# EAGLE design Arduino101BiomedDevBoard (EAGLE 8.1.0)
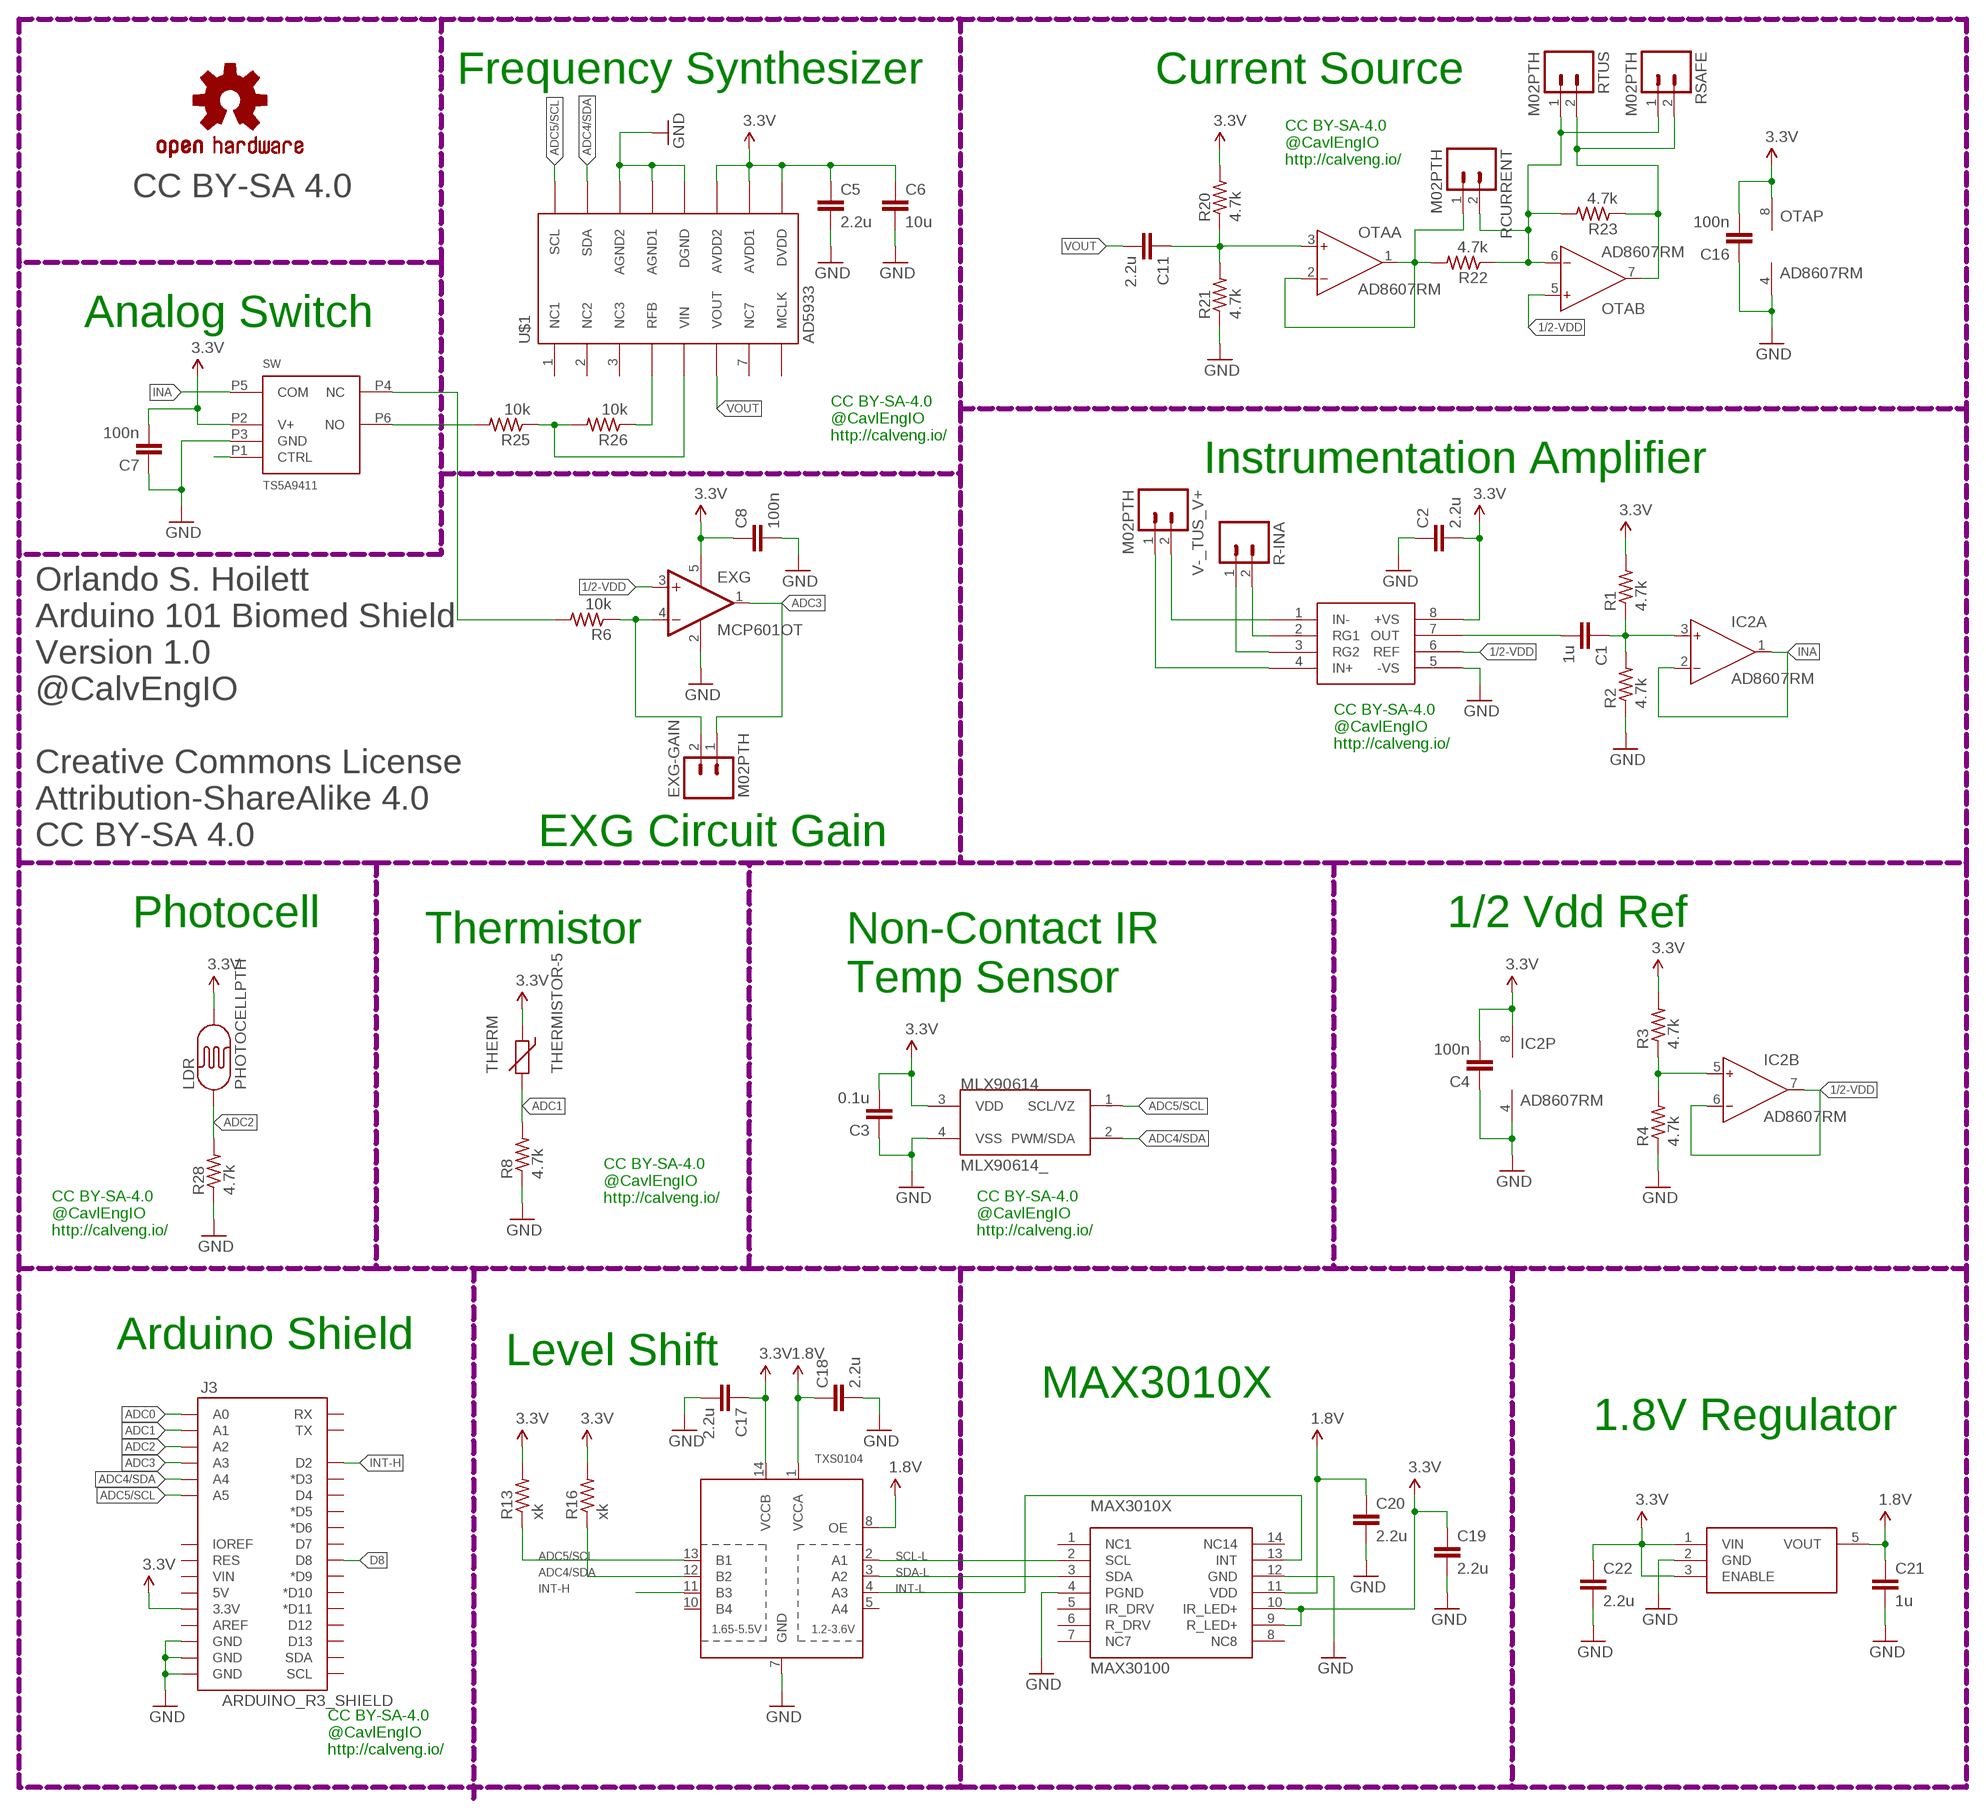
[diagram p0: schematic, sheet 1]

## Parts
1.8V  MIC5504  [SOT23-5]
C1  1u  C-EUC0402  [C0402]
C2  2.2u  C-EUC0402  [C0402]
C3  0.1u  C-EUC0402  [C0402]
C4  100n  C-EUC0402  [C0402]
C5  2.2u  C-EUC0402  [C0402]
C6  10u  C-EUC0805  [C0805]
C7  100n  C-EUC0402  [C0402]
C8  100n  C-EUC0402  [C0402]
C11  2.2u  C-EUC0402  [C0402]
C16  100n  C-EUC0402  [C0402]
C17  2.2u  C-EUC0402  [C0402]
C18  2.2u  C-EUC0402  [C0402]
C19  2.2u  C-EUC0402  [C0402]
C20  2.2u  C-EUC0402  [C0402]
C21  1u  C-EUC0402  [C0402]
C22  2.2u  C-EUC0402  [C0402]
EXG  MCP601OT  [SOT23-5]
EXG-GAIN  M02PTH  [1X02]
IC2  AD8607RM  [MSOP08]
INA  AD8220  [MSOP08]
J3  ARDUINO_R3_SHIELD  [UNO_R3_SHIELD]
LDR  PHOTOCELLPTH  [PHOTOCELL]
LOGO3  OSHW-LOGOM  [OSHW-LOGO-M]
MAX3010X  MAX30100  [OESIP14]
MLX90614  MLX90614_  [TO-39]
OTA  AD8607RM  [MSOP08]
R1  4.7k  R-US_R0402  [R0402]
R2  4.7k  R-US_R0402  [R0402]
R3  4.7k  R-US_R0402  [R0402]
R4  4.7k  R-US_R0402  [R0402]
R6  10k  R-US_R0402  [R0402]
R8  4.7k  R-US_R0402  [R0402]
R13  xk  R-US_R0402  [R0402]
R16  xk  R-US_R0402  [R0402]
R20  4.7k  R-US_R0402  [R0402]
R21  4.7k  R-US_R0402  [R0402]
R22  4.7k  R-US_R0402  [R0402]
R23  4.7k  R-US_R0402  [R0402]
R25  10k  R-US_R0402  [R0402]
R26  10k  R-US_R0402  [R0402]
R28  4.7k  R-US_R0402  [R0402]
R-INA  M02PTH  [1X02]
RCURRENT  M02PTH  [1X02]
RSAFE  M02PTH  [1X02]
RTUS  M02PTH  [1X02]
SW  TS5A9411  [SOT-363]
THERM  THERMISTOR-5  [R-5]
TXS0104  TXB0104PWR  [TSSOP14]
U$1  AD5933  [SSOP-16]
V-_TUS_V+  M02PTH  [1X02]

## Nets
1.8V: 1.8V.5(VOUT) C18.1 C20.1 C21.1 MAX3010X.11(VDD) TXS0104.1(VCCA) TXS0104.8(OE)
1/2-VDD: EXG.3(+IN) IC2.6(B:IN-) IC2.7(B:OUT) INA.6(REF) OTA.5(B:IN+)
3.3V: 1.8V.1(VIN) 1.8V.3(ENABLE) C2.2 C3.2 C4.2 C5.1 C6.1 C7.2 C8.1 C16.2 C17.1 C19.1 C22.1 EXG.5(V+) IC2.8(P:V+) INA.8(+VS) J3.3.3V LDR.2 MAX3010X.9(R_LED+) MAX3010X.10(IR_LED+) MLX90614.3(VDD) OTA.8(P:V+) R1.2 R3.2 R13.2 R16.2 R20.2 SW.P2(V+) THERM.1 TXS0104.14(VCCB) U$1.9(DVDD) U$1.10(AVDD1) U$1.11(AVDD2)
ADC0: J3.A0
ADC1: J3.A1 R8.2 THERM.2
ADC2: J3.A2 LDR.1 R28.2
ADC3: EXG-GAIN.1 EXG.1(OUT) J3.A3
ADC4/SDA: J3.A4 MLX90614.2(PWM/SDA) R16.1 TXS0104.12(B2) U$1.15(SDA)
ADC5/SCL: J3.A5 MLX90614.1(SCL/VZ) R13.1 TXS0104.13(B1) U$1.16(SCL)
D8: J3.D8 SW.P1(CTRL)
GND: 1.8V.2(GND) C2.1 C3.1 C4.1 C5.2 C6.2 C7.1 C8.2 C16.1 C17.2 C18.2 C19.2 C20.2 C21.2 C22.2 EXG.2(V-) IC2.4(P:V-) INA.5(-VS) J3.GND@0(GND) J3.GND@1(GND) J3.GND@2(GND) MAX3010X.4(PGND) MAX3010X.12(GND) MLX90614.4(VSS) OTA.4(P:V-) R2.1 R4.1 R8.1 R21.1 R28.1 SW.P3(GND) TXS0104.7(GND) U$1.12(DGND) U$1.13(AGND1) U$1.14(AGND2)
INA: IC2.1(A:OUT) IC2.2(A:IN-) SW.P5(COM)
INT-H: J3.D2 TXS0104.11(B3)
INT-L: MAX3010X.13(INT) TXS0104.4(A3)
N$1: C1.1 IC2.3(A:IN+) R1.1 R2.2
N$3: C1.2 INA.7(OUT)
N$4: IC2.5(B:IN+) R3.1 R4.2
N$6: INA.3(RG2) R-INA.1
N$7: EXG-GAIN.2 EXG.4(-IN) R6.1
N$9: C11.1 OTA.3(A:IN+) R20.1 R21.2
N$10: R25.2 SW.P6(NO)
N$12: R25.1 R26.2 U$1.5(VIN)
N$13: R6.2 SW.P4(NC)
N$14: OTA.1(A:OUT) OTA.2(A:IN-) R22.2 RCURRENT.1
N$16: OTA.6(B:IN-) R22.1 R23.2 RCURRENT.2 RSAFE.1 RTUS.1
N$17: OTA.7(B:OUT) R23.1 RSAFE.2 RTUS.2
N$18: INA.1(IN-) V-_TUS_V+.2
N$19: INA.4(IN+) V-_TUS_V+.1
N$20: INA.2(RG1) R-INA.2
N$24: R26.1 U$1.4(RFB)
SCL-L: MAX3010X.2(SCL) TXS0104.2(A1)
SDA-L: MAX3010X.3(SDA) TXS0104.3(A2)
VOUT: C11.2 U$1.6(VOUT)
Unconnected: J3.5V J3.AREF J3.D3(*D3) J3.D4 J3.D5(*D5) J3.D6(*D6) J3.D7 J3.D9(*D9) J3.D10(*D10) J3.D11(*D11) J3.D12 J3.D13 J3.IOREF J3.RES J3.RX J3.SCL J3.SDA J3.TX J3.VIN MAX3010X.1(NC1) MAX3010X.5(IR_DRV) MAX3010X.6(R_DRV) MAX3010X.7(NC7) MAX3010X.8(NC8) MAX3010X.14(NC14) TXS0104.5(A4) TXS0104.10(B4) U$1.1(NC1) U$1.2(NC2) U$1.3(NC3) U$1.7(NC7) U$1.8(MCLK)

## Notes on the sheet
- Frequency Synthesizer | Current Source
- CC BY-SA-4.0
  @CavlEngIO
  http://calveng.io/
- CC BY-SA 4.0
- Analog Switch
- CC BY-SA-4.0
  @CavlEngIO
  http://calveng.io/
- Instrumentation Amplifier
- CC BY-SA-4.0
  @CavlEngIO
  http://calveng.io/
- Orlando S. Hoilett
  Arduino 101 Biomed Shield
  Version 1.0
  @CalvEngIO
  
  Creative Commons License
  Attribution-ShareAlike 4.0
  CC BY-SA 4.0
- EXG Circuit Gain
- Photocell | 1/2 Vdd Ref
- Thermistor
- Non-Contact IR
  Temp Sensor
- CC BY-SA-4.0
  @CavlEngIO
  http://calveng.io/
- CC BY-SA-4.0
  @CavlEngIO
  http://calveng.io/
- CC BY-SA-4.0
  @CavlEngIO
  http://calveng.io/
- Arduino Shield
- Level Shift
- MAX3010X
- 1.8V Regulator
- CC BY-SA-4.0
  @CavlEngIO
  http://calveng.io/

## Library data of the parts
1.8V = OrlandoRonMod:MIC5504
C1-C8 C11 C16-C22 = resistor:C-EU: CAPACITOR, European symbol
EXG = linear:MCP601: Single Op Amp 2.7V to 6.0V Single Supply CMOS Source: http://ww1.microchip.com/downloads/en/DeviceDoc/21314g.pdf
EXG-GAIN R-INA RCURRENT RSAFE RTUS V-_TUS_V+ = SparkFun-Connectors:M02: Standard 2-pin 0.1" header. Use with - straight break away headers ( PRT-00116) - right angle break away headers (PRT-00553) - swiss pins (PRT-00743) - machine pins (PRT-00117) - female headers (PRT-00115) Molex polarized connector foot print use with: PRT-08233 with associated crimp pins and housings. 2.54_SCREWTERM for use with PRT-10571. 3.5mm Screw Terminal footprints for PRT-08084 5mm Screw Terminal footprints for use with PRT-08432
IC2 OTA = analog-devices:AD8607: Precision Micropower, Low Noise CMOS, Rail-to-Rail Input/Output Operational Amplifiers Source: http://www.analog.com/static/imported-files/data_sheets/AD8603_8607_8609.pdf; MF: ALTERA CORPORATION; MPN: AD8607ARMZ-REEL; OC_FARNELL: 1464990; OC_NEWARK: 59K6925
INA = Orlando:AD8220
J3 = SparkFun-Boards:ARDUINO_R3_SHIELD: Shield form compatible with the Arduino Uno R3.
LDR = SparkFun-Sensors:PHOTOCELL: CdS photoresistor. This is a low cost way to detect light levels. Resistance decreases with more incoming light. SparkFun SKU: SEN-09088
LOGO3 = SparkFun-Aesthetics:OSHW-LOGO: Open Source Hardware Logo This logo indicates the piece of hardware it is found on incorporates a OSHW license and/or adheres to the definition of open source hardware found here: http://freedomdefined.org/OSHW
MAX3010X = OrlandoRonMod:MAX30100
MLX90614 = SparkFun-Sensors:MLX90614: Non-contact PIR I2C interface temperature sensor
R1-R4 R6 R8 R13 R16 R20-R23 R25 R26 R28 = resistor:R-US_: RESISTOR, American symbol
SW = Orlando:TS5A9411
THERM = varistor:THERMISTOR: THERMISTOR
TXS0104 = SparkFun-DigitalIC:TXB0104PWR: 4-Bit Bi-Directional Level Shifter 1.2V-3.6V (VCCA) to 1.65V-5.5V (VCCB) bi-directional level shifter with auto direction sensing. Max data rate - VCCA 1.8V: 20Mbps (50ns), VCCA 3.3V: 100Mbps (10ns) Digikey: 296-21929-1-ND (TSSOP) IC-11329
U$1 = Orlando:AD5933

## Net classes
0 default: width 0.152 mm, drill 0.305 mm, clearance 0.152 mm

## Board
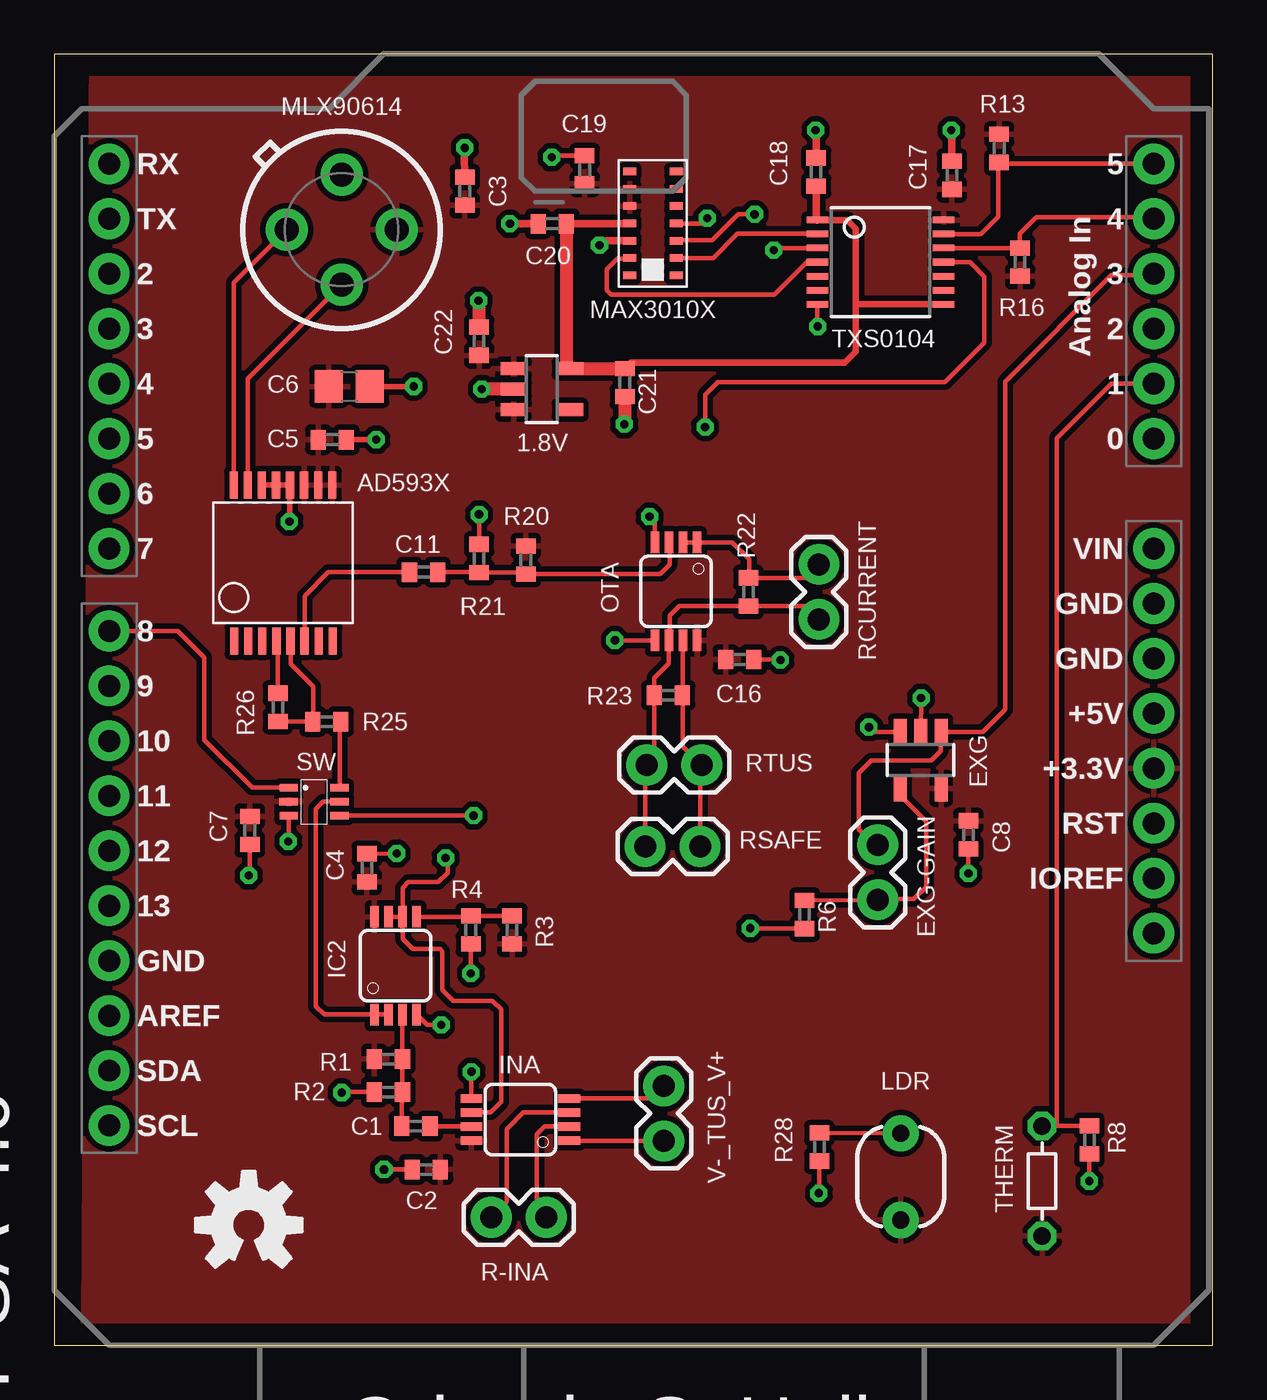
[diagram p1: board, top side]
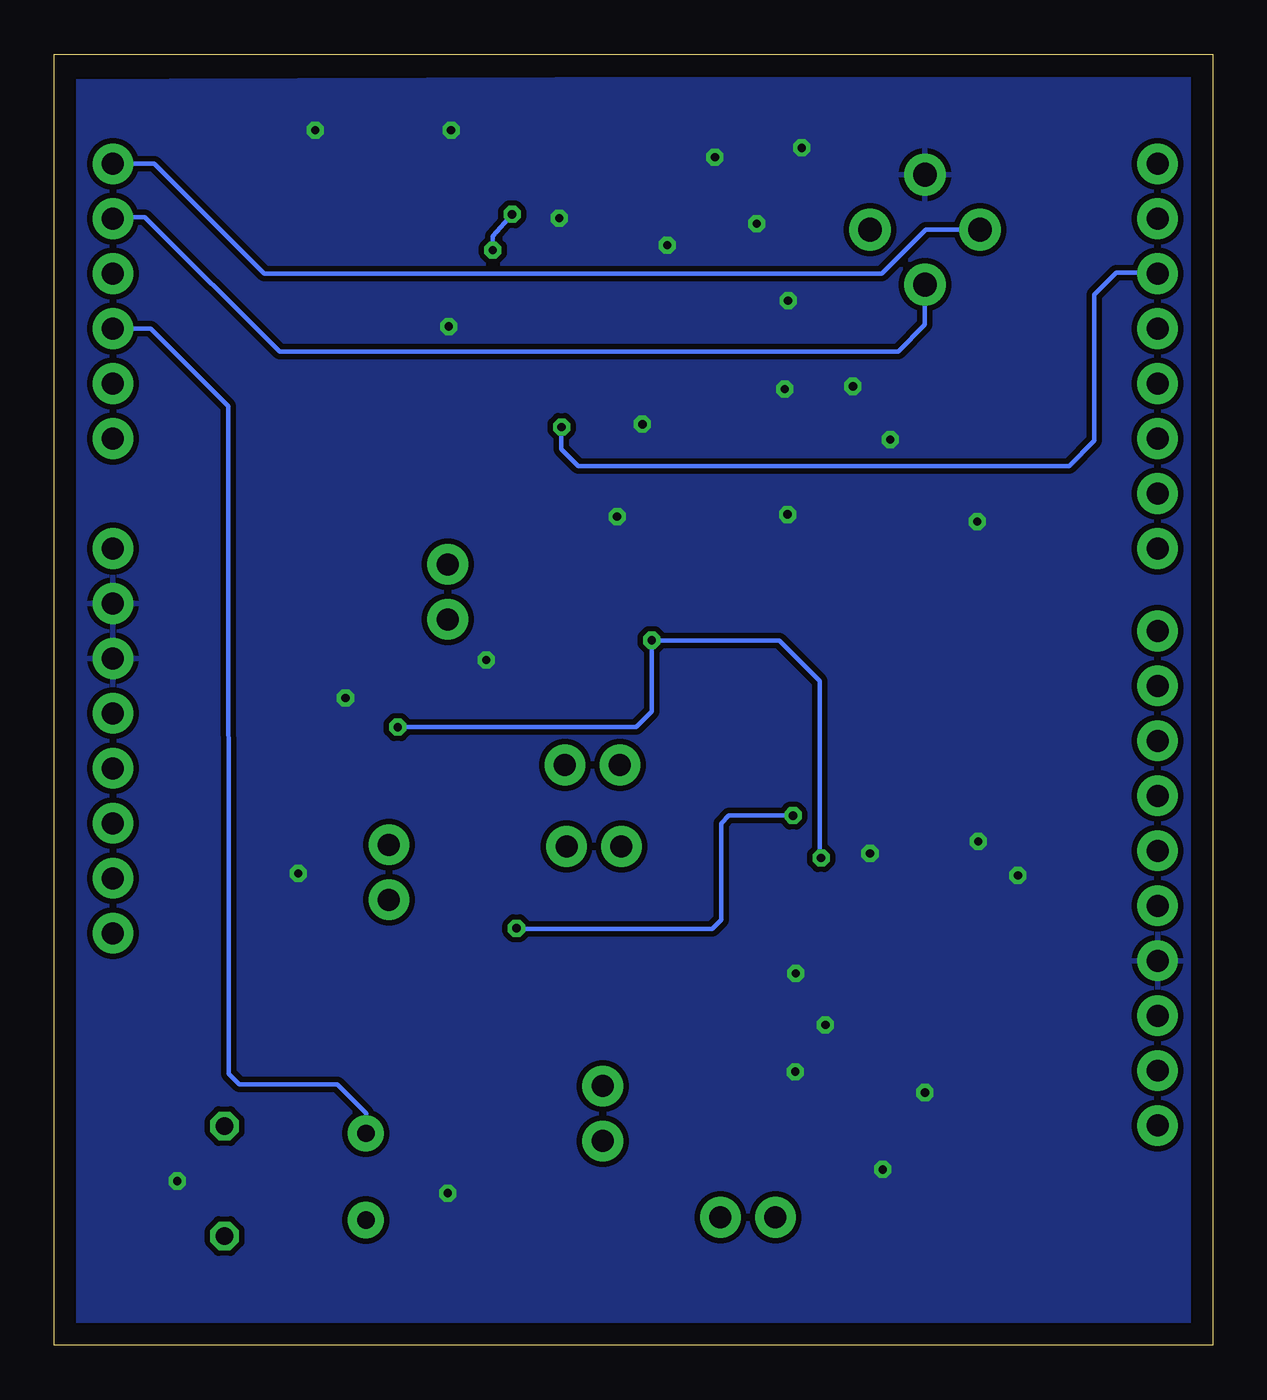
[diagram p2: board, bottom side, seen from below]

Size 53.52 x 59.68 mm. Coordinates in mm from the lower left corner, seen from the top.
Outline: 0,0 53.52,0 53.52,59.68 0,59.68 0,0
Copper layers (1*16): Top 0.035mm / dielectric 1.5mm / Bottom 0.035mm
Design rules "default": minimum track width 10mil, minimum drill 24mil, track to track 8mil, track to pad 8mil, pad to pad 8mil, via to via 8mil, smd to smd 8mil, copper to edge 40mil, drill to drill 8mil, minimum pad ring 10mil, minimum via ring 8mil, stop-mask expansion 4mil, vias tented up to drill 0mil, thermal gap 10mil

### Footprints (pad centres in the part's own frame; a part is rotated, then mirrored left to right if it is on the bottom)
SOT23-5 = smd 0.6 x 1.2: 1 -0.95,-1.306; 2 0,-1.306; 3 0.95,-1.306; 4 0.95,1.306; 5 -0.95,1.306
C0402 = smd 0.7 x 0.9: 1 -0.65,0; 2 0.65,0
C0805 = smd 1.3 x 1.5: 1 -0.95,0; 2 0.95,0
1X02 = drill 1.016 pad 1.88: 1 0,0; 2 2.54,0
MSOP08 = smd 0.4 x 1: 1 -0.976,-2.263; 2 -0.326,-2.263; 3 0.324,-2.263; 4 0.974,-2.263; 5 0.974,2.262; 6 0.324,2.262; 7 -0.326,2.262; 8 -0.976,2.262
UNO_R3_SHIELD = drill 1.016 pad 1.88: 3.3V 50.8,26.67; 5V 50.8,29.21; A0 50.8,41.91; A1 50.8,44.45; A2 50.8,46.99; A3 50.8,49.53; A4 50.8,52.07; A5 50.8,54.61; AREF 2.54,15.24; D2 2.54,49.53; D3 2.54,46.99; D4 2.54,44.45; D5 2.54,41.91; D6 2.54,39.37; D7 2.54,36.83; D8 2.54,33.02; D9 2.54,30.48; D10 2.54,27.94; D11 2.54,25.4; D12 2.54,22.86; D13 2.54,20.32; GND@0 50.8,31.75; GND@1 50.8,34.29; GND@2 2.54,17.78; IOREF 50.8,21.59; NC 50.8,19.05; RES 50.8,24.13; RX 2.54,54.61; SCL 2.54,10.16; SDA 2.54,12.7; TX 2.54,52.07; VIN 50.8,36.83
PHOTOCELL = drill 0.8 pad 1.676: 1 -2,0; 2 2,0
OESIP14 = smd 0.6 x 0.35: 1 -1.08,2.54; 2 -1.08,1.74; 3 -1.08,0.94; 4 -1.08,0.14; 5 -1.08,-0.66; 6 -1.08,-1.46; 7 -1.08,-2.26; 8 1.07,-2.26; 9 1.07,-1.46; 10 1.07,-0.66; 11 1.07,0.14; 12 1.07,0.94; 13 1.07,1.74; 14 1.07,2.54
TO-39 = drill 1.1 pad 1.93: 1 2.54,0; 2 0,2.54; 3 -2.54,0; 4 0,-2.54
R0402 = smd 0.7 x 0.9: 1 -0.65,0; 2 0.65,0
SOT-363 = smd 0.85 x 0.35: P1 -1.176,0.611; P2 -1.18,-0.038; P3 -1.176,-0.689; P4 1.172,-0.689; P5 1.168,-0.038; P6 1.172,0.611
R-5 = drill 0.813 octagon: 1 -2.54,0; 2 2.54,0
TSSOP14 = smd 0.305 x 0.991: 1 -1.95,-2.918; 2 -1.3,-2.918; 3 -0.65,-2.918; 4 0,-2.918; 5 0.65,-2.918; 6 1.3,-2.918; 7 1.95,-2.918; 8 1.95,2.918; 9 1.3,2.918; 10 0.65,2.918; 11 0,2.918; 12 -0.65,2.918; 13 -1.3,2.918; 14 -1.95,2.918
SSOP-16 = smd 1.25 x 0.38: 1 -3.583,2.017; 2 -3.583,1.367; 3 -3.583,0.716; 4 -3.583,0.066; 5 -3.583,-0.584; 6 -3.583,-1.234; 7 -3.583,-1.885; 8 -3.583,-2.535; 9 3.627,-2.51; 10 3.627,-1.859; 11 3.627,-1.209; 12 3.627,-0.559; 13 3.627,0.091; 14 3.627,0.742; 15 3.627,1.392; 16 3.627,2.042

### Placement (x,y rotation side)
1.8V  22.53,44.2 270 top
C1  16.71,10.13 0 top
C2  17.2,8.13 0 top
C3  18.97,53.34 270 top
C4  14.45,22.07 270 top
C5  12.85,41.86 0 top
C6  13.64,44.32 0 top
C7  9.04,23.8 90 top
C8  42.24,23.6 270 top
C11  17.07,35.74 180 top
C16  31.67,31.7 180 top
C17  41.48,54.08 90 top
C18  35.2,54.23 90 top
C19  24.51,54.33 90 top
C20  23.01,51.84 180 top
C21  26.37,44.5 270 top
C22  19.63,46.41 90 top
EXG  40.03,27.05 180 top
EXG-GAIN  38.05,23.14 270 top
IC2  15.77,17.55 0 top
INA  21.54,10.44 90 top
J3  0,0 0 top
LDR  39.12,7.8 270 top
LOGO3  8.99,5.56 0 top
MAX3010X  27.66,51.99 180 top
MLX90614  13.28,51.56 180 top
OTA  28.73,34.85 180 top
R1  15.44,13.23 180 top
R2  15.44,11.71 0 top
R3  21.16,19.2 270 top
R4  19.25,19.2 90 top
R6  34.67,19.91 270 top
R8  47.83,9.5 90 top
R13  43.66,55.32 90 top
R16  44.63,50.06 270 top
R20  21.79,36.3 90 top
R21  19.63,36.37 270 top
R22  32.08,34.82 90 top
R23  28.37,30.05 180 top
R25  12.6,28.83 0 top
R26  10.34,29.49 270 top
R28  35.36,9.17 90 top
R-INA  20.19,5.92 0 top
RCURRENT  35.33,36.09 270 top
RSAFE  27.3,23.06 0 top
RTUS  27.38,26.82 0 top
SW  12.01,25.17 0 top
THERM  45.64,7.59 90 top
TXS0104  38.18,50.06 270 top
U$1  10.34,36.14 90 top
V-_TUS_V+  28.17,11.99 270 top

### Tracks (layer width: path | path; a pad name or v marks a point on that pad's centre or on a via)
1.8V
  Top 0.305: TXS0104.1 36.63,52.01 37.03,51.61 37.03,48.03 | 37.03,48.03 37.03,45.92 36.52,45.41 26.63,45.41 C21.1 | TXS0104.8 37.12,48.11 37.03,48.03
  Top 0.356: 23.66,45.32 1.8V.5 | C20.1 26.58,51.84 MAX3010X.11 | C21.1 | C18.1 35.2,52.07 TXS0104.1
  Top 0.61: C20.1 23.66,45.32 | 1.8V.5 C21.1
1/2-VDD  (via drill 0.38)
  Top 0.203: IC2.7 IC2.6 | IC2.6 16.1,21.15 16.36,21.41 17.75,21.41 18.19,21.84 18.19,22.43 v18.09,22.53 | v25.91,32.59 OTA.5 | EXG.3 37.86,28.36 v37.64,28.57 | IC2.6 16.1,18.78 16.56,18.31 17.83,18.31 17.93,18.21 17.93,16.43 18.44,15.93 20.24,15.93 20.65,15.52 20.65,11.25 20.17,10.77 INA.6
  Bottom 0.203: v37.64,28.57 26.62,28.57 25.91,29.29 v25.91,32.59 20.02,32.59 18.14,30.71 18.14,22.58 v18.09,22.53
3.3V
  pour Top (isolate 0.254): 1.73,60.12 53.19,60.12 53.19,1.02 1.35,1.02
ADC1
  Top 0.203: J3.A1 48.84,44.45 46.33,41.94 46.33,10.18 46.41,10.15 | R8.2 46.41,10.15 | 46.41,10.15 45.68,10.15 THERM.2
ADC2
  Top 0.203: LDR.1 R28.2
  Bottom 0.203: 39.15,9.83 LDR.1 39.09,9.82 39.09,10.72 40.44,12.06 44.96,12.06 45.44,12.55 45.44,12.88 45.47,43.41 49.05,46.99 J3.A2
ADC3
  Top 0.203: J3.A3 50.72,49.45 48.84,49.45 43.94,44.55 43.94,29.39 42.91,28.36 EXG.1 40.97,28.35 40.97,27.48 40.51,27.03 37.74,27.03 37.19,26.47 37.19,23.85 37.9,23.14 EXG-GAIN.1
ADC4/SDA
  Top 0.203: TXS0104.12 R16.1 44.6,50.74 44.6,51.38 45.36,52.15 50.72,52.15 J3.A4 | U$1.15 8.95,44.68 MLX90614.2
  Bottom 0.203: MLX90614.2 13.28,47.17 14.53,45.92 43.1,45.92 49.33,52.15 50.72,52.15 J3.A4
ADC5/SCL
  Top 0.203: J3.A5 43.72,54.61 R13.1 43.61,54.62 43.61,52.17 42.8,51.36 TXS0104.13 | U$1.16 8.3,49.11 MLX90614.1
  Bottom 0.203: MLX90614.1 13.26,51.56 15.29,49.53 43.81,49.53 48.9,54.61 J3.A5
D8
  Top 0.203: J3.D8 5.71,33.02 6.93,31.8 6.93,27.99 9.14,25.78 SW.P1
GND  (via drill 0.38)
  Top 0.203: R28.1 35.36,7.06 v35.33,7.04 | MAX3010X.4 29.93,51.85 v30.18,52.09 | TXS0104.7 35.26,47.11 v35.28,47.09 | OTA.4 27.75,38.06 v27.51,38.3 | C16.1 33.53,31.7 v33.55,31.67 | SW.P3 10.84,23.31 v10.82,23.29 | C7.1 9.04,21.77 v8.99,21.72 | EXG.2 v40.06,29.92 | C8.2 v42.24,21.82 | C4.1 v15.82,22.73 | C2.1 v15.24,8.13 | INA.5 v19.28,12.65 | v19.25,17.2 R4.1 | v17.88,14.81 17.23,14.81 IC2.4 | R2.1 13.31,11.71 v13.28,11.68 | R21.1 v19.63,38.41 | R8.1 v47.83,7.59 | C19.2 23.05,54.98 v22.99,54.91
  Top 0.254: U$1.14 U$1.13 U$1.12 10.9,38.1 v10.87,38.08 | C5.2 v14.88,41.86 | C6.2 v16.61,44.32
  Top 0.356: C20.2 v21.06,51.84 | 26.36,42.6 v26.34,42.57 | MAX3010X.12 25.53,51.05 v25.2,50.85 | C18.2 35.2,55.8 v35.18,56.16 | C17.2 41.48,56.13 v41.45,56.16 | C3.1 18.95,55.04 v18.97,55.35
  Top 0.61: 1.8V.2 v19.76,44.2 | C21.2 26.36,42.6 | C22.2 19.63,48.26 v19.61,48.28
  pour Bottom (isolate 0.254): 54.13,58.42 54.13,0.51 0.66,0.51 0.66,58.62
INA
  Top 0.203: IC2.2 IC2.1 12.47,15.29 12.09,15.67 12.09,24.79 12.43,25.13 SW.P5
INT-H  (via drill 0.38)
  Top 0.203: TXS0104.11 42.32,50.06 42.98,49.4 42.98,46.35 41.15,44.53 30.66,44.53 30.07,43.94 v30.07,42.44
  Bottom 0.203: J3.D2 2.59,49.58 4.45,49.58 5.46,48.56 5.46,41.81 6.63,40.64 29.31,40.64 30.1,41.43 30.1,42.42 v30.07,42.44
INT-L
  Top 0.203: TXS0104.4 34.77,50.06 33.27,48.56 25.73,48.56 25.53,48.77 25.53,49.73 26.01,50.22 26.55,50.22 MAX3010X.13
N$1
  Top 0.203: C1.1 16.06,11.68 R2.2 R1.1 IC2.3
N$3
  Top 0.203: INA.7 17.38,10.11 C1.2
N$4
  Top 0.203: IC2.5 19.21,19.81 R4.2 R3.1
N$6
  Top 0.203: INA.3 21.68,10.76 20.9,9.98 20.9,6.63 R-INA.1
N$7
  Top 0.203: EXG.4 39.08,25.41 40.28,24.21 40.28,21.18 39.73,20.62 38.08,20.62 EXG-GAIN.2 R6.1
N$9
  Top 0.203: OTA.3 28.45,37.07 28.45,36.09 28,35.65 R20.1 21.72,35.72 R21.2 19.62,35.74 C11.1
N$10
  Top 0.203: SW.P6 13.19,28.77 R25.2
N$12
  Top 0.203: R26.2 R25.1 11.96,28.84 11.96,30.45 10.92,31.5 U$1.5
N$13  (via drill 0.38)
  Top 0.203: SW.P4 v19.38,24.48 v19.38,24.49 | v32.16,19.28 34.66,19.28 R6.2
  Bottom 0.203: v19.38,24.49 22.35,24.49 22.71,24.13 22.71,19.66 23.11,19.25 32.13,19.25 v32.16,19.28
N$14
  Top 0.203: OTA.2 OTA.1 31.34,37.11 32.11,36.35 32.11,35.5 R22.2 34.71,35.47 RCURRENT.1
N$16
  Top 0.203: RCURRENT.2 34.71,34.17 R22.1 28.89,34.17 28.45,33.73 28.45,32.63 OTA.6 28.4,31.52 27.72,30.85 R23.2 27.72,27.16 RTUS.1 27.3,26.75 RSAFE.1
N$17
  Top 0.203: OTA.7 29.05,30.08 | 29.05,30.08 R23.1 | 29.05,30.08 29.05,27.69 RTUS.2 29.84,26.75 RSAFE.2
N$18
  Top 0.203: INA.1 28.15,9.46 V-_TUS_V+.2
N$19
  Top 0.203: INA.4 27.59,11.41 V-_TUS_V+.1
N$20
  Top 0.203: INA.2 22.66,10.11 22.3,9.75 22.3,6.35 R-INA.2
N$24
  Top 0.203: R26.1 10.34,32.49 U$1.4
SCL-L
  Top 0.203: MAX3010X.2 30.44,50.25 31.57,51.38 35.24,51.38 TXS0104.2
SDA-L  (via drill 0.38)
  Top 0.203: TXS0104.3 33.34,50.71 v33.25,50.62 | MAX3010X.3 28.77,51.08 30.4,51.08 31.6,52.27 v32.36,52.27
  Bottom 0.203: v33.25,50.62 33.25,51.26 v32.36,52.27
VOUT
  Top 0.203: U$1.6 11.57,34.63 12.68,35.74 C11.2

### Text on the board
tNames: AD593X
tplace-old: Creative Commons License / Attribution-ShareAlike 4.0 International / CC BY-SA-4.0 | Orlando S. Hoilett / @CalvEngIO / Biomed Shield